# Altium project xMas-Tree.PrjPcb
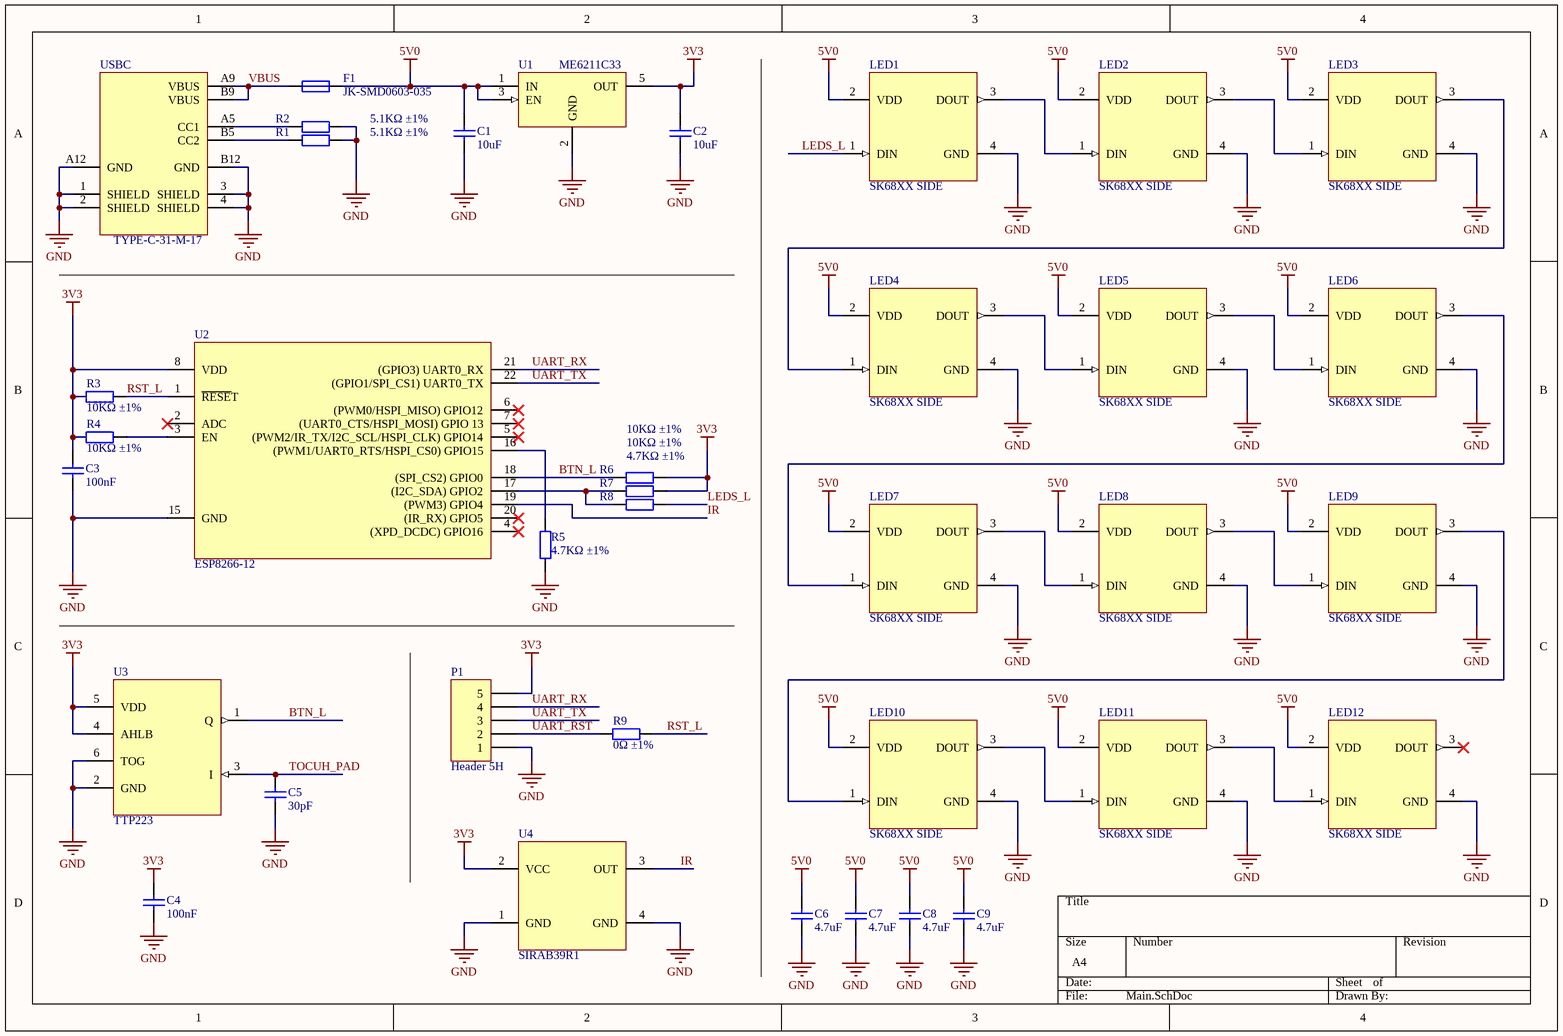
[diagram p0: Main.SchDoc]
1 sheet, 37 parts. Net scope: global (net labels, ports and power ports of the same name join across sheets).
Board file: BoardPanel.PcbDoc

## Sheet Main.SchDoc
size A4

### Parts
C1  10uF  [0603_C]
C2  10uF  [0603_C]
C3  100nF  [0603_C]
C4  100nF  [0603_C]
C5  30pF  [0603_C]
C6  4.7uF  [0603_C]
C7  4.7uF  [0603_C]
C8  4.7uF  [0603_C]
C9  4.7uF  [0603_C]
F1  JK-SMD0603-035  [0603]
LED1  SK68XX SIDE  [SK68XX-SIDE]
LED2  SK68XX SIDE  [SK68XX-SIDE]
LED3  SK68XX SIDE  [SK68XX-SIDE]
LED4  SK68XX SIDE  [SK68XX-SIDE]
LED5  SK68XX SIDE  [SK68XX-SIDE]
LED6  SK68XX SIDE  [SK68XX-SIDE]
LED7  SK68XX SIDE  [SK68XX-SIDE]
LED8  SK68XX SIDE  [SK68XX-SIDE]
LED9  SK68XX SIDE  [SK68XX-SIDE]
LED10  SK68XX SIDE  [SK68XX-SIDE]
LED11  SK68XX SIDE  [SK68XX-SIDE]
LED12  SK68XX SIDE  [SK68XX-SIDE]
P1  Header 5H  [HDR1X5H]
R1  5.1KΩ ±1%  [0603_R]
R2  5.1KΩ ±1%  [0603_R]
R3  10KΩ ±1%  [0603_R]
R4  10KΩ ±1%  [0603_R]
R5  4.7KΩ ±1%  [0603_R]
R6  10KΩ ±1%  [0603_R]
R7  10KΩ ±1%  [0603_R]
R8  4.7KΩ ±1%  [0603_R]
R9  0Ω ±1%  [0603_R]
U1  ME6211C33  [SOT-23-5]
U2  ESP8266-12  [ESP-12E]
U3  TTP223  [SOT-23-6]
U4  SIRAB39R1  [SMD_SIRAB39R1]
USBC  TYPE-C-31-M-17  [USBC]

### Nets
3V3: C2.2 C3.2 C4.2 P1.5 R3.1 R4.1 R6.1 R7.2 U1.5(OUT) U2.8(VDD) U3.4(AHLB) U3.5(VDD) U4.2(VCC)
5V0: C1.2 C6.2 C7.2 C8.2 C9.2 F1.2 LED1.2(VDD) LED2.2(VDD) LED3.2(VDD) LED4.2(VDD) LED5.2(VDD) LED6.2(VDD) LED7.2(VDD) LED8.2(VDD) LED9.2(VDD) LED10.2(VDD) LED11.2(VDD) LED12.2(VDD) U1.1(IN) U1.3(EN)
GND: C1.1 C2.1 C3.1 C4.1 C5.1 C6.1 C7.1 C8.1 C9.1 LED1.4(GND) LED2.4(GND) LED3.4(GND) LED4.4(GND) LED5.4(GND) LED6.4(GND) LED7.4(GND) LED8.4(GND) LED9.4(GND) LED10.4(GND) LED11.4(GND) LED12.4(GND) P1.1 R1.1 R2.1 R5.1 U1.2(GND) U2.15(GND) U3.2(GND) U3.6(TOG) U4.1(GND) U4.4(GND) USBC.1(SHIELD) USBC.2(SHIELD) USBC.3(SHIELD) USBC.4(SHIELD) USBC.A12(GND) USBC.B12(GND)
BTN_L: R6.2 U2.18((SPI_CS2)_GPIO0) U3.1(Q)
IR: U2.19((PWM3)_GPIO4) U4.3(OUT)
LEDS_L: LED1.1(DIN) R8.2
RST_L: R3.2 R9.2 U2.1(~{RESE}T)
TOCUH_PAD: C5.2 U3.3(I)
UART_RST: P1.2 R9.1
UART_RX: P1.4 U2.21((GPIO3)_UART0_RX)
UART_TX: P1.3 U2.22((GPIO1/SPI_CS1)_UART0_TX)
VBUS: F1.1 USBC.A9(VBUS) USBC.B9(VBUS)
NetLED1_3: LED1.3(DOUT) LED2.1(DIN)
NetLED2_3: LED2.3(DOUT) LED3.1(DIN)
NetLED3_3: LED3.3(DOUT) LED4.1(DIN)
NetLED4_3: LED4.3(DOUT) LED5.1(DIN)
NetLED5_3: LED5.3(DOUT) LED6.1(DIN)
NetLED6_3: LED6.3(DOUT) LED7.1(DIN)
NetLED7_3: LED7.3(DOUT) LED8.1(DIN)
NetLED8_3: LED8.3(DOUT) LED9.1(DIN)
NetLED9_3: LED9.3(DOUT) LED10.1(DIN)
NetLED10_3: LED10.3(DOUT) LED11.1(DIN)
NetLED11_3: LED11.3(DOUT) LED12.1(DIN)
NetR1_2: R1.2 USBC.B5(CC2)
NetR2_2: R2.2 USBC.A5(CC1)
NetR4_2: R4.2 U2.3(EN)
NetR5_2: R5.2 U2.16((PWM1/UART0_RTS/HSPI_CS0)_GPIO15)
NetR7_1: R7.1 R8.1 U2.17((I2C_SDA)_GPIO2)

Not connected (* = marked no-connect by the designer): LED12 3(DOUT)*; U2 2(ADC)* 4((XPD_DCDC)_GPIO16)* 5((PWM2/IR_TX/I2C_SCL/HSPI_CLK)_GPIO14)* 6((PWM0/HSPI_MISO)_GPIO12)* 7((UART0_CTS/HSPI_MOSI)_GPIO_13)* 20((IR_RX)_GPIO5)*

### Library data of the parts
C1 C2 = 0603 10uF (106) 10% 10V: Chip capacitors; Manufacturer: Samsung Electro-Mechanics; PartNumber: CL10A106KP8NNNC; Tolerance: 10%; Voltage: 10V; ComponentLink1Description: Supplier link; ComponentLink1URL: http://www.szlcsc.com/product/details_20411.html; Package: 0603; Supplier: LC; SuppliersPartNumber: C19702; Capacitance: 10uF
C3 C4 = 0603 100nF (104) 10% 50V: Chip capacitors; Manufacturer: YAGEO; PartNumber: CC0603KRX7R9BB104; Tolerance: 10%; Voltage: 50V; ComponentLink1Description: Supplier link; ComponentLink1URL: http://www.szlcsc.com/product/details_15331.html; Package: 0603; Supplier: LC; SuppliersPartNumber: C14663; Capacitance: 100nF
C5 = 0603 30pF (300) 5% 50V: Chip capacitors; Manufacturer: Samsung Electro-Mechanics; PartNumber: CL10C300JB8NNNC; Tolerance: 5%; Voltage: 50V; ComponentLink1Description: Supplier link; ComponentLink1URL: http://www.szlcsc.com/product/details_23122.html; Package: 0603; Supplier: LC; SuppliersPartNumber: C22397; Capacitance: 30pF
C6-C9 = 0603 4.7uF (475) 10% 16V: Chip capacitors; Manufacturer: Samsung Electro-Mechanics; PartNumber: CL10A475KO8NNNC; Tolerance: 10%; Voltage: 16V; ComponentLink1Description: Supplier link; ComponentLink1URL: http://www.szlcsc.com/product/details_20375.html; Package: 0603; Supplier: LC; SuppliersPartNumber: C19666; Capacitance: 4.7uF
F1 = JK-SMD0603-035: PTC Resettable Fuse; Manufacturer: Jinrui Electronic Materials Co.; Voltage - Max: 6V; Current - Max: 40A; Current - Hold (Ih): 350mA; Current - Trip (It): 750mA; Package: 0603; ComponentLink1Description: Supplier Link; ComponentLink1URL: https://lcsc.com/product-detail/PTC-Resettable-Fuses_Jinrui-Electronic-Materials-Co-JK-SMD0603-035_C369144.html; PartNumber: JK-SMD0603-035; SuppliersPartNumber: C369144; Supplier: LC
LED1-LED12 = SK6805-SIDE: Addressable LED; Manufacturer: Shenzhen Normand Electronic Co.,Ltd; PartNumber: SK6812 SIDE; Supply Voltage: 5V; Current: 12mA; ComponentLink1Description: Datasheet; ComponentLink1URL: http://www.normandled.com/upload/201804/SK6812%204020%20SIDE%20LED%20Datasheet.pdf
P1 = Header 5H: Header, 5-Pin, Right Angle; LatestRevisionDate: 17-Jul-2002; LatestRevisionNote: Re-released for DXP Platform.; Publisher: Altium Limited
R1 R2 = 0603 5.1K (5101) 1%: Chip resistor; Manufacturer: Uniroyal Elec; PartNumber: 0603WAF5101T5E; Power: 1/10W; ComponentLink1Description: Supplier link; ComponentLink1URL: http://www.szlcsc.com/product/details_23913.html; Package: 0603; Supplier: LC; SuppliersPartNumber: C23186; Resistance: 5.1KΩ; Tolerance: 1%
R3 R4 R6 R7 = 0603 10K (1002) 1%: Chip resistor; Manufacturer: Uniroyal Elec; PartNumber: 0603WAF1002T5E; Power: 1/10W; ComponentLink1Description: Supplier link; ComponentLink1URL: http://www.szlcsc.com/product/details_26547.html; Package: 0603; Supplier: LC; SuppliersPartNumber: C25804; Resistance: 10KΩ; Tolerance: 1%
R5 R8 = 0603 4.7K (4701) 1%: Chip resistor; Manufacturer: Uniroyal Elec; PartNumber: 0603WAF4701T5E; Power: 1/10W; ComponentLink1Description: Supplier link; ComponentLink1URL: http://www.szlcsc.com/product/details_23889.html; Package: 0603; Supplier: LC; SuppliersPartNumber: C23162; Resistance: 4.7KΩ; Tolerance: 1%
R9 = 0603 0R (0R0) 1%: Chip resistor; Manufacturer: Uniroyal Elec; PartNumber: 0603WAF0000T5E; Power: 1/10W; ComponentLink1Description: Supplier link; ComponentLink1URL: http://www.szlcsc.com/product/details_21903.html; Package: 0603; Supplier: LC; SuppliersPartNumber: C21189; Resistance: 0Ω; Tolerance: 1%
U1 = ME6211C33: LDO; Manufacturer: MICRONE(Nanjing Micro One Elec); PartNumber: ME6211C33M5G-N; Voltage - Output: 3.3V; Voltage - Input: 6V; Package: SOT-23-5; Supplier: LC; SuppliersPartNumber: C82942; ComponentLink1Description: Supplier Link; ComponentLink1URL: https://lcsc.com/product-detail/Dropout-Regulators-LDO_MICRONE-Nanjing-Micro-One-Elec-ME6211C33M5G-N_C82942.html
U3 = TTP223: Touch Pad Detector IC; Manufacturer: Tontek Design Tech; PartNumber: TTP223N-HA6; ComponentLink1Description: Supplier Link; ComponentLink1URL: https://lcsc.com/product-detail/Touch-Screen-Controller-ICs_TTP223N-HA6_C93723.html; Package: SOT-23-6; SuppliersPartNumber: C93723; Supplier: LC
U4 = SIRAB39R1: Infrared remote receiver; Manufacturer: Hangzhou Silan Microelectronics; ComponentLink1Description: Supplier Link; ComponentLink1URL: https://lcsc.com/product-detail/Infrared-Receivers_Hangzhou-Silan-Microelectronics-SIRAB39R1_C393728.html; Package: SMD; Supplier: LC; SuppliersPartNumber: C393728; PartNumber: SIRAB39R1
USBC = TYPE-C-31-M-17: USB Connectors; Manufacturer: Korean Hroparts Elec; Gender: Female; Current: 3A; Contacts: 6; Supplier: LC; PartNumber: TYPE-C-31-M-17; SuppliersPartNumber: C283540